# EAGLE design media_player_v0001a (EAGLE 6.4)

## Sheet 1 of 6: PSU
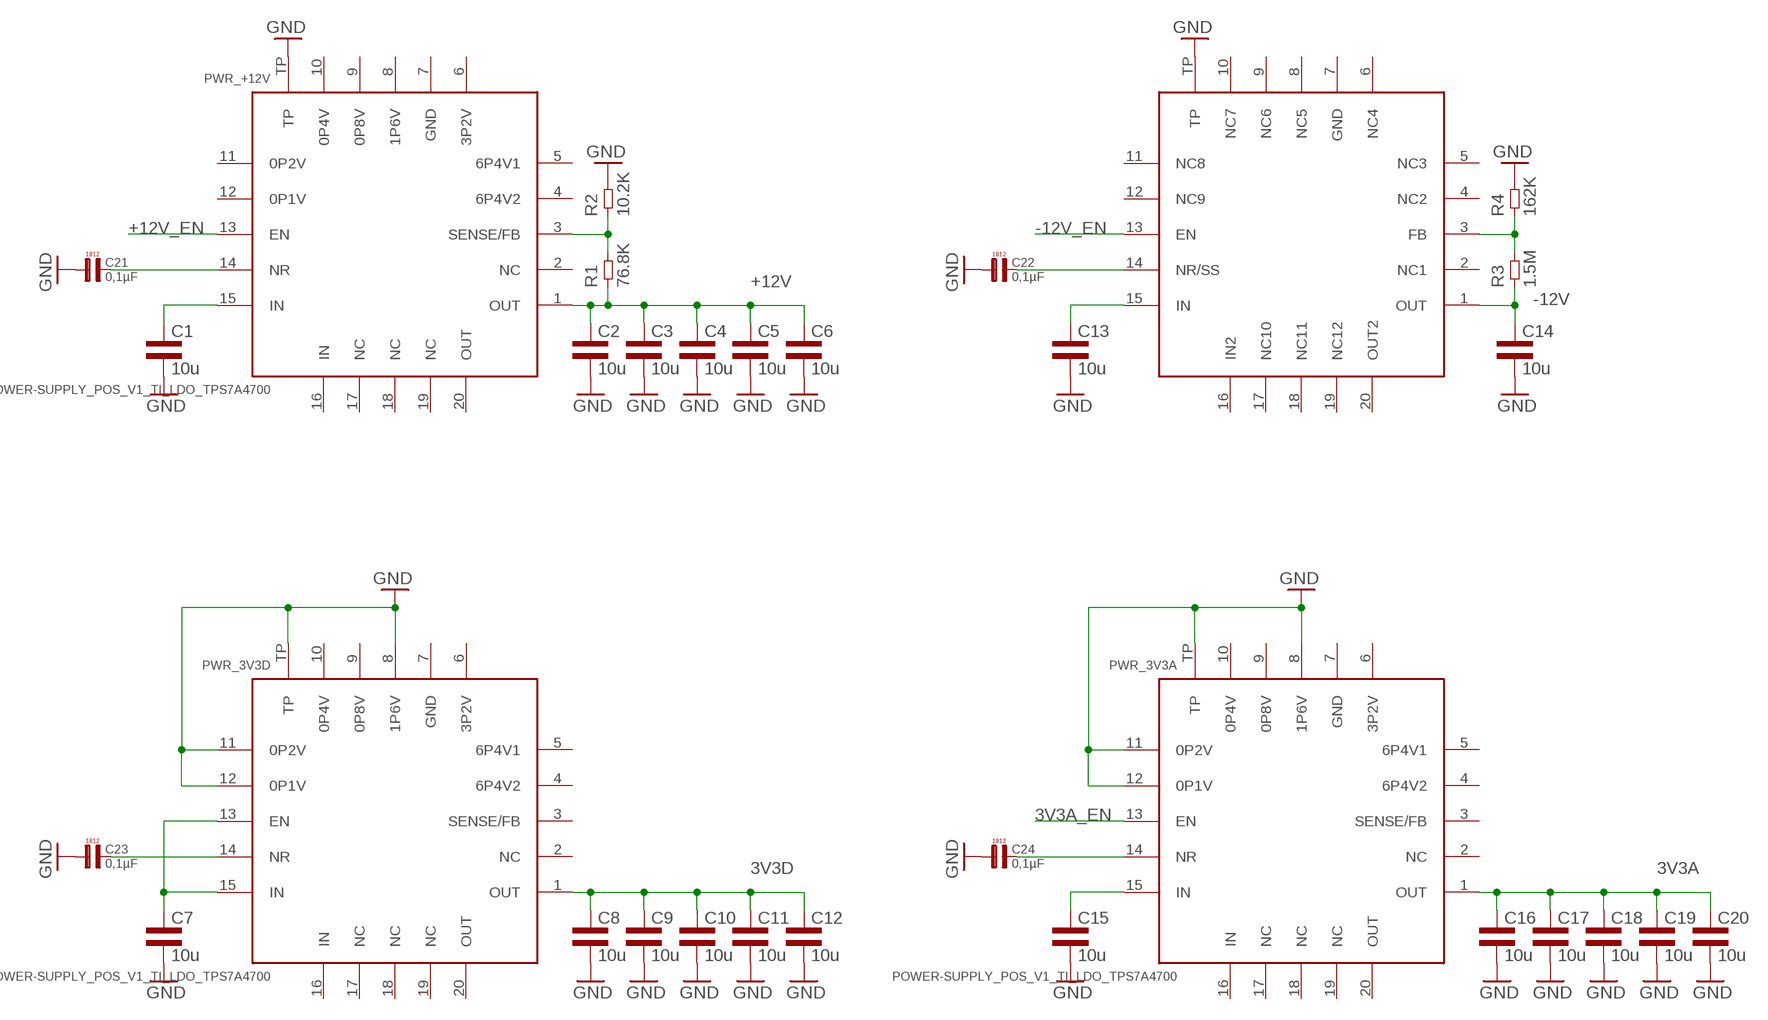
[diagram p0: schematic, sheet 1]

### Parts
C1  10u  CAP0805L3  [0805L3]
C2  10u  CAP0805L3  [0805L3]
C3  10u  CAP0805L3  [0805L3]
C4  10u  CAP0805L3  [0805L3]
C5  10u  CAP0805L3  [0805L3]
C6  10u  CAP0805L3  [0805L3]
C7  10u  CAP0805L3  [0805L3]
C8  10u  CAP0805L3  [0805L3]
C9  10u  CAP0805L3  [0805L3]
C10  10u  CAP0805L3  [0805L3]
C11  10u  CAP0805L3  [0805L3]
C12  10u  CAP0805L3  [0805L3]
C13  10u  CAP0805L3  [0805L3]
C14  10u  CAP0805L3  [0805L3]
C15  10u  CAP0805L3  [0805L3]
C16  10u  CAP0805L3  [0805L3]
C17  10u  CAP0805L3  [0805L3]
C18  10u  CAP0805L3  [0805L3]
C19  10u  CAP0805L3  [0805L3]
C20  10u  CAP0805L3  [0805L3]
C21  0,1µF  [L4,8]
C22  0,1µF  [L4,8]
C23  0,1µF  [L4,8]
C24  0,1µF  [L4,8]
PWR_3V3A  POWER-SUPPLY_POS_V1_TI_LDO_TPS7A4700  [POWER-SUPPLY_POS_V1_TI_LDO_VQFN-20]
PWR_3V3D  POWER-SUPPLY_POS_V1_TI_LDO_TPS7A4700  [POWER-SUPPLY_POS_V1_TI_LDO_VQFN-20]
PWR_+12V  POWER-SUPPLY_POS_V1_TI_LDO_TPS7A4700  [POWER-SUPPLY_POS_V1_TI_LDO_VQFN-20]
PWR_-12V  POWER-SUPPLY_POS_V1_TI_LDO_TPS7A3301RGWT  [POWER-SUPPLY_POS_V1_TI_LDO_VQFN-20]
R1  76.8K  RES0603L3  [0603L3]
R2  10.2K  RES0603L3  [0603L3]
R3  1.5M  RES0603L3  [0603L3]
R4  162K  RES0603L3  [0603L3]

### Nets
3V3A: C16.1 C17.1 C18.1 C19.1 C20.1 PWR_3V3A.1(OUT) ; also sheet 4
3V3A_EN: PWR_3V3A.13(EN)
3V3A_NR: C24.P$2 PWR_3V3A.14(NR)
3V3D: C8.1 C9.1 C10.1 C11.1 C12.1 PWR_3V3D.1(OUT) ; also sheet 2,3,4
3V3D_NR: C23.P$2 PWR_3V3D.14(NR)
+12V: C2.1 C3.1 C4.1 C5.1 C6.1 PWR_+12V.1(OUT) R1.P$1
+12V_EN: PWR_+12V.13(EN)
+12V_NR: C21.P$2 PWR_+12V.14(NR)
+12V_SENSE: PWR_+12V.3(SENSE/FB) R1.P$2 R2.P$1
-12V: C14.1 PWR_-12V.1(OUT) R3.P$1
-12V_EN: PWR_-12V.13(EN)
-12V_NR: C22.P$2 PWR_-12V.14(NR/SS)
-12V_SENSE: PWR_-12V.3(FB) R3.P$2 R4.P$1
GND: C1.2 C2.2 C3.2 C4.2 C5.2 C6.2 C7.2 C8.2 C9.2 C10.2 C11.2 C12.2 C13.2 C14.2 C15.2 C16.2 C17.2 C18.2 C19.2 C20.2 C21.P$1 C22.P$1 C23.P$1 C24.P$1 PWR_3V3A.8(1P6V) PWR_3V3A.11(0P2V) PWR_3V3A.12(0P1V) PWR_3V3A.TP PWR_3V3D.8(1P6V) PWR_3V3D.11(0P2V) PWR_3V3D.12(0P1V) PWR_3V3D.TP PWR_+12V.TP PWR_-12V.TP R2.P$2 R4.P$2 ; also sheet 2,3,4,6
VIN: C1.1 C7.1 C13.1 C15.1 PWR_3V3A.15(IN) PWR_3V3D.13(EN) PWR_3V3D.15(IN) PWR_+12V.15(IN) PWR_-12V.15(IN)
Unconnected: PWR_3V3A.2(NC) PWR_3V3A.3(SENSE/FB) PWR_3V3A.4(6P4V2) PWR_3V3A.5(6P4V1) PWR_3V3A.6(3P2V) PWR_3V3A.7(GND) PWR_3V3A.9(0P8V) PWR_3V3A.10(0P4V) PWR_3V3A.16(IN) PWR_3V3A.17(NC) PWR_3V3A.18(NC) PWR_3V3A.19(NC) PWR_3V3A.20(OUT) PWR_3V3D.2(NC) PWR_3V3D.3(SENSE/FB) PWR_3V3D.4(6P4V2) PWR_3V3D.5(6P4V1) PWR_3V3D.6(3P2V) PWR_3V3D.7(GND) PWR_3V3D.9(0P8V) PWR_3V3D.10(0P4V) PWR_3V3D.16(IN) PWR_3V3D.17(NC) PWR_3V3D.18(NC) PWR_3V3D.19(NC) PWR_3V3D.20(OUT) PWR_+12V.2(NC) PWR_+12V.4(6P4V2) PWR_+12V.5(6P4V1) PWR_+12V.6(3P2V) PWR_+12V.7(GND) PWR_+12V.8(1P6V) PWR_+12V.9(0P8V) PWR_+12V.10(0P4V) PWR_+12V.11(0P2V) PWR_+12V.12(0P1V) PWR_+12V.16(IN) PWR_+12V.17(NC) PWR_+12V.18(NC) PWR_+12V.19(NC) PWR_+12V.20(OUT) PWR_-12V.2(NC1) PWR_-12V.4(NC2) PWR_-12V.5(NC3) PWR_-12V.6(NC4) PWR_-12V.7(GND) PWR_-12V.8(NC5) PWR_-12V.9(NC6) PWR_-12V.10(NC7) PWR_-12V.11(NC8) PWR_-12V.12(NC9) PWR_-12V.16(IN2) PWR_-12V.17(NC10) PWR_-12V.18(NC11) PWR_-12V.19(NC12) PWR_-12V.20(OUT2)

### Notes on the sheet
- +12V
- -12V
- 3V3D | 3V3A

## Sheet 2 of 6: MCU
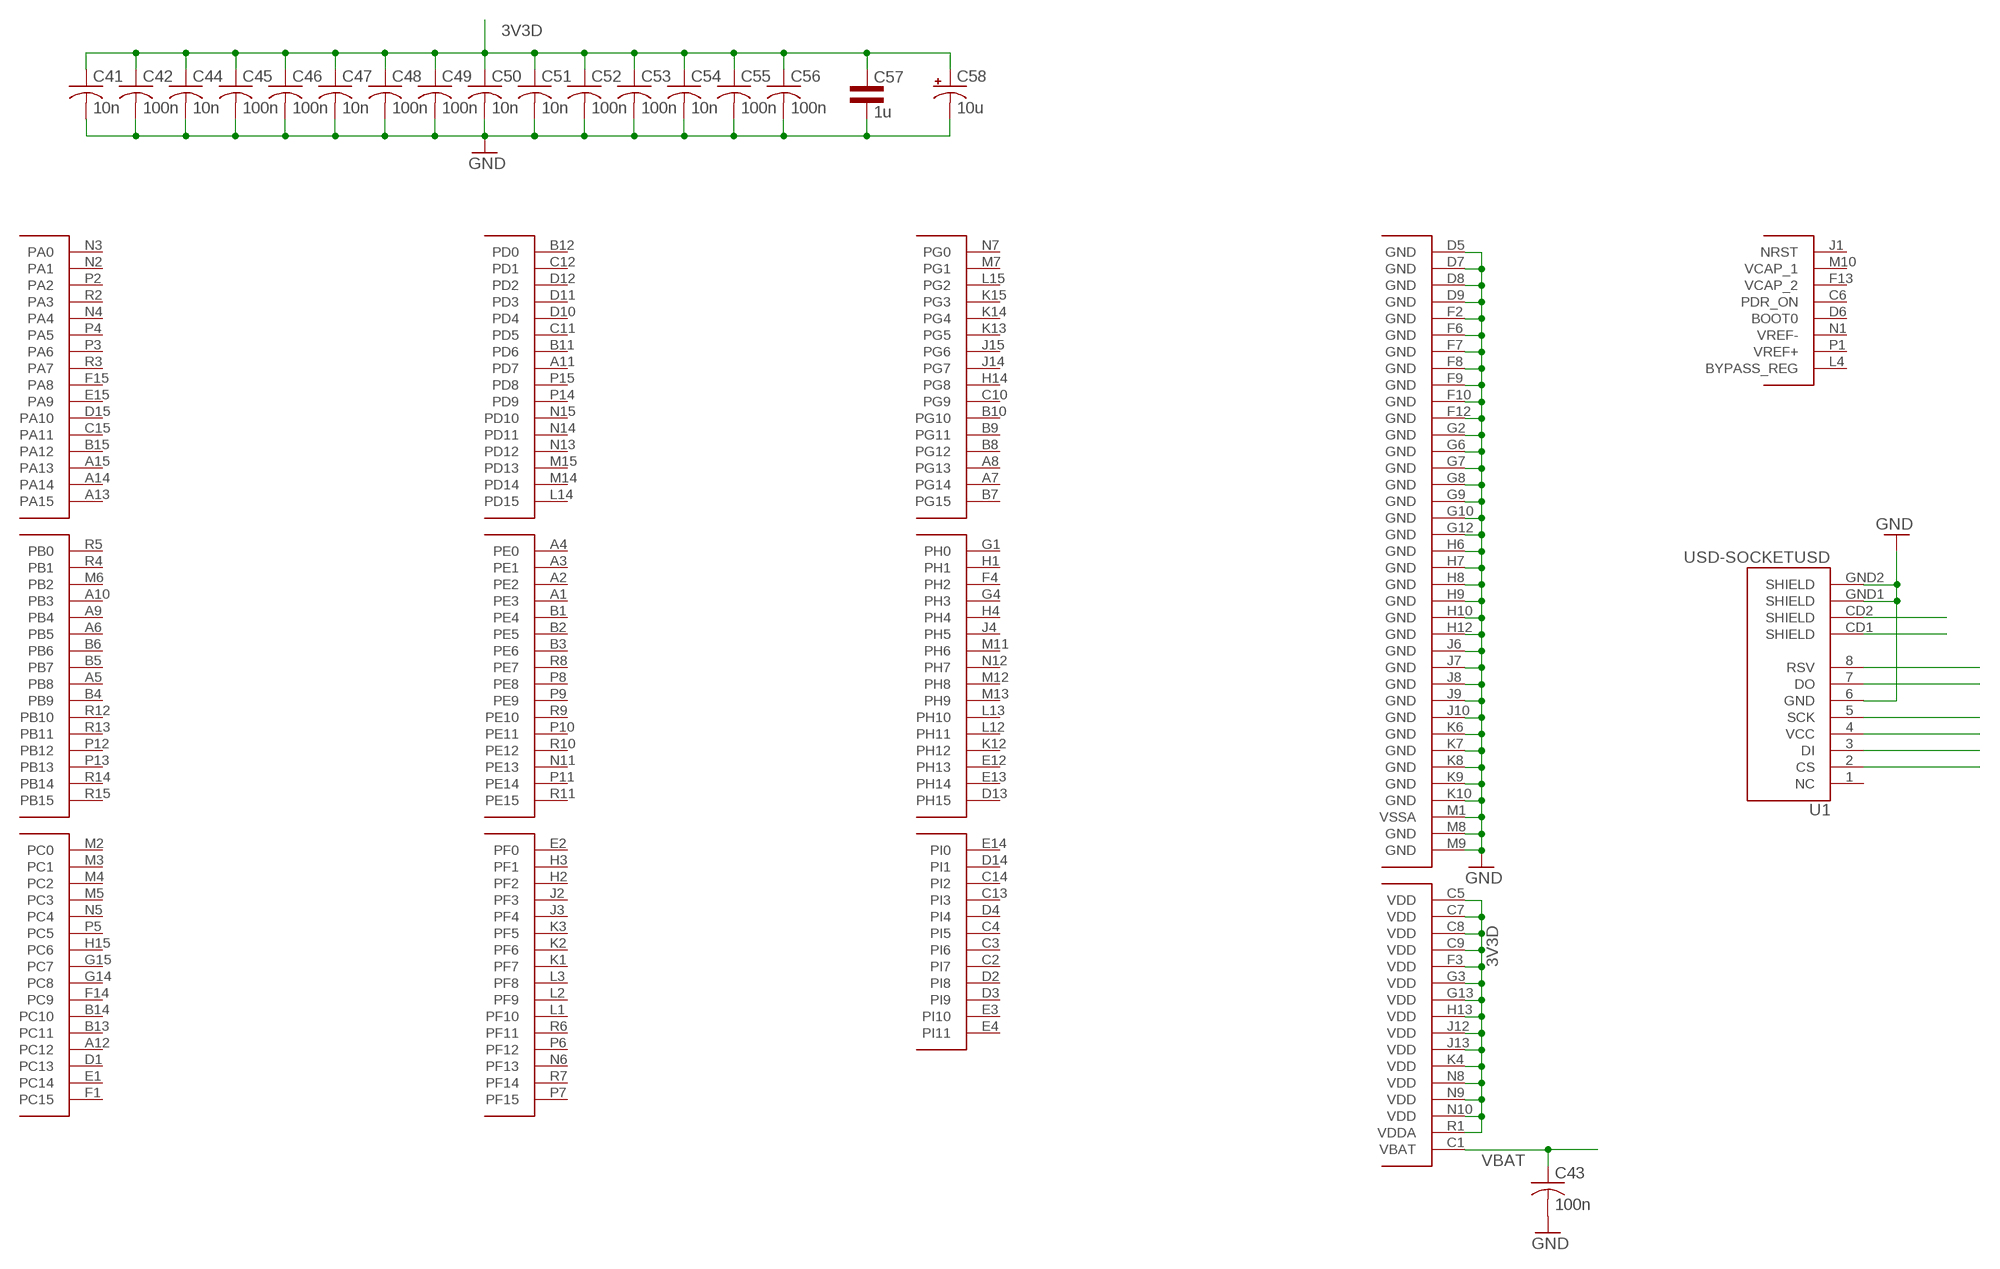
[diagram p1: schematic, sheet 2]

### Parts
C41  10n  C-USC0201  [C0201]
C42  100n  C-USC0201  [C0201]
C43  100n  C-USC0201  [C0201]
C44  10n  C-USC0201  [C0201]
C45  100n  C-USC0201  [C0201]
C46  100n  C-USC0201  [C0201]
C47  10n  C-USC0201  [C0201]
C48  100n  C-USC0201  [C0201]
C49  100n  C-USC0201  [C0201]
C50  10n  C-USC0201  [C0201]
C51  10n  C-USC0201  [C0201]
C52  100n  C-USC0201  [C0201]
C53  100n  C-USC0201  [C0201]
C54  10n  C-USC0201  [C0201]
C55  100n  C-USC0201  [C0201]
C56  100n  C-USC0201  [C0201]
C57  1u  CAP0805L3  [0805L3]
C58  10u  CPOL-USA/3216-18R  [A/3216-18R]
U1  USD-SOCKETUSD  [USD-SOCKET-PP]
U$1  STM32_32BIT_MCU_STM32F407IG  [STM32_32BIT_MCU_UFBGA176+25]

### Nets
3V3D: C41.1 C42.1 C44.1 C45.1 C46.1 C47.1 C48.1 C49.1 C50.1 C51.1 C52.1 C53.1 C54.1 C55.1 C56.1 C57.1 C58.+ U$1.C5(VDD) U$1.C7(VDD) U$1.C8(VDD) U$1.C9(VDD) U$1.F3(VDD) U$1.G3(VDD) U$1.G13(VDD) U$1.H13(VDD) U$1.J12(VDD) U$1.J13(VDD) U$1.K4(VDD) U$1.N8(VDD) U$1.N9(VDD) U$1.N10(VDD) U$1.R1(VDDA) ; also sheet 1,3,4
GND: C41.2 C42.2 C43.2 C44.2 C45.2 C46.2 C47.2 C48.2 C49.2 C50.2 C51.2 C52.2 C53.2 C54.2 C55.2 C56.2 C57.2 C58.- U1.6(GND) U1.GND1(SHIELD) U1.GND2(SHIELD) U$1.D5(GND) U$1.D7(GND) U$1.D8(GND) U$1.D9(GND) U$1.F2(GND) U$1.F6(GND) U$1.F7(GND) U$1.F8(GND) U$1.F9(GND) U$1.F10(GND) U$1.F12(GND) U$1.G2(GND) U$1.G6(GND) U$1.G7(GND) U$1.G8(GND) U$1.G9(GND) U$1.G10(GND) U$1.G12(GND) U$1.H6(GND) U$1.H7(GND) U$1.H8(GND) U$1.H9(GND) U$1.H10(GND) U$1.H12(GND) U$1.J6(GND) U$1.J7(GND) U$1.J8(GND) U$1.J9(GND) U$1.J10(GND) U$1.K6(GND) U$1.K7(GND) U$1.K8(GND) U$1.K9(GND) U$1.K10(GND) U$1.M1(VSSA) U$1.M8(GND) U$1.M9(GND) ; also sheet 1,3,4,6
N$22: U1.2(CS)
N$23: U1.3(DI)
N$24: U1.4(VCC)
N$25: U1.5(SCK)
N$27: U1.7(DO)
N$28: U1.8(RSV)
N$31: U1.CD2(SHIELD)
N$32: U1.CD1(SHIELD)
VBAT: C43.1 U$1.C1(VBAT)
Unconnected: U1.1(NC) U$1.A1(PE3) U$1.A2(PE2) U$1.A3(PE1) U$1.A4(PE0) U$1.A5(PB8) U$1.A6(PB5) U$1.A7(PG14) U$1.A8(PG13) U$1.A9(PB4) U$1.A10(PB3) U$1.A11(PD7) U$1.A12(PC12) U$1.A13(PA15) U$1.A14 U$1.A15(PA13) U$1.B1(PE4) U$1.B2(PE5) U$1.B3(PE6) U$1.B4(PB9) U$1.B5(PB7) U$1.B6 U$1.B7(PG15) U$1.B8(PG12) U$1.B9(PG11) U$1.B10(PG10) U$1.B11(PD6) U$1.B12(PD0) U$1.B13(PC11) U$1.B14(PC10) U$1.B15(PA12) U$1.C2(PI7) U$1.C3(PI6) U$1.C4(PI5) U$1.C6(PDR_ON) U$1.C10(PG9) U$1.C11(PD5) U$1.C12(PD1) U$1.C13(PI3) U$1.C14(PI2) U$1.C15(PA11) U$1.D1(PC13) U$1.D2(PI8) U$1.D3(PI9) U$1.D4(PI4) U$1.D6(BOOT0) U$1.D10(PD4) U$1.D11(PD3) U$1.D12(PD2) U$1.D13(PH15) U$1.D14(PI1) U$1.D15(PA10) U$1.E1(PC14) U$1.E2(PF0) U$1.E3(PI10) U$1.E4(PI11) U$1.E12(PH13) U$1.E13(PH14) U$1.E14(PI0) U$1.E15(PA9) U$1.F1(PC15) U$1.F4(PH2) U$1.F13(VCAP_2) U$1.F14(PC9) U$1.F15(PA8) U$1.G1(PH0) U$1.G4(PH3) U$1.G14(PC8) U$1.G15(PC7) U$1.H1 U$1.H2(PF2) U$1.H3(PF1) U$1.H4 U$1.H14(PG8) U$1.H15(PC6) U$1.J1(NRST) U$1.J2(PF3) U$1.J3(PF4) U$1.J4(PH5) U$1.J14(PG7) U$1.J15(PG6) U$1.K1(PF7) U$1.K2(PF6) U$1.K3(PF5) U$1.K12(PH12) U$1.K13(PG5) U$1.K14(PG4) U$1.K15(PG3) U$1.L1(PF10) U$1.L2(PF9) U$1.L3(PF8) U$1.L4(BYPASS_REG) U$1.L12(PH11) U$1.L13(PH10) U$1.L14(PD15) U$1.L15(PG2) U$1.M2(PC0) U$1.M3(PC1) U$1.M4(PC2) U$1.M5(PC3) U$1.M6(PB2) U$1.M7(PG1) U$1.M10(VCAP_1) U$1.M11(PH6) U$1.M12(PH8) U$1.M13(PH9) U$1.M14(PD14) U$1.M15(PD13) U$1.N1(VREF-) U$1.N2(PA1) U$1.N3(PA0) U$1.N4(PA4) U$1.N5(PC4) U$1.N6(PF13) U$1.N7(PG0) U$1.N11(PE13) U$1.N12(PH7) U$1.N13(PD12) U$1.N14(PD11) U$1.N15(PD10) U$1.P1(VREF+) U$1.P2(PA2) U$1.P3(PA6) U$1.P4(PA5) U$1.P5(PC5) U$1.P6(PF12) U$1.P7(PF15) U$1.P8(PE8) U$1.P9(PE9) U$1.P10(PE11) U$1.P11(PE14) U$1.P12(PB12) U$1.P13(PB13) U$1.P14(PD9) U$1.P15(PD8) U$1.R2(PA3) U$1.R3(PA7) U$1.R4(PB1) U$1.R5(PB0) U$1.R6(PF11) U$1.R7(PF14) U$1.R8(PE7) U$1.R9(PE10) U$1.R10(PE12) U$1.R11(PE15) U$1.R12(PB10) U$1.R13(PB11) U$1.R14(PB14) U$1.R15(PB15)

## Sheet 3 of 6: SRAM
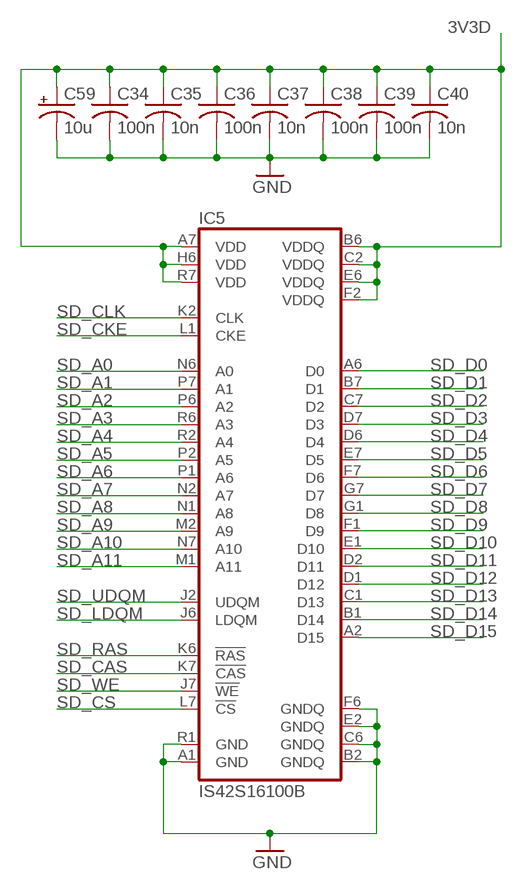
[diagram p2: schematic, sheet 3]

### Parts
C34  100n  C-USC0201  [C0201]
C35  10n  C-USC0201  [C0201]
C36  100n  C-USC0201  [C0201]
C37  10n  C-USC0201  [C0201]
C38  100n  C-USC0201  [C0201]
C39  100n  C-USC0201  [C0201]
C40  10n  C-USC0201  [C0201]
C59  10u  CPOL-USA/3216-18R  [A/3216-18R]
IC5  IS42S16100B  [MBGA60]

### Nets
3V3D: C34.1 C35.1 C36.1 C37.1 C38.1 C39.1 C40.1 C59.+ IC5.A7(VDD) IC5.B6(VDDQ) IC5.C2(VDDQ) IC5.E6(VDDQ) IC5.F2(VDDQ) IC5.H6(VDD) IC5.R7(VDD) ; also sheet 1,2,4
GND: C34.2 C35.2 C36.2 C37.2 C38.2 C39.2 C40.2 C59.- IC5.A1(GND) IC5.B2(GNDQ) IC5.C6(GNDQ) IC5.E2(GNDQ) IC5.F6(GNDQ) IC5.R1(GND) ; also sheet 1,2,4,6
SD_A0: IC5.N6(A0)
SD_A1: IC5.P7(A1)
SD_A2: IC5.P6(A2)
SD_A3: IC5.R6(A3)
SD_A4: IC5.R2(A4)
SD_A5: IC5.P2(A5)
SD_A6: IC5.P1(A6)
SD_A7: IC5.N2(A7)
SD_A8: IC5.N1(A8)
SD_A9: IC5.M2(A9)
SD_A10: IC5.N7(A10)
SD_A11: IC5.M1(A11)
SD_CAS: IC5.K7(!CAS)
SD_CKE: IC5.L1(CKE)
SD_CLK: IC5.K2(CLK)
SD_CS: IC5.L7(!CS)
SD_D0: IC5.A6(D0)
SD_D1: IC5.B7(D1)
SD_D2: IC5.C7(D2)
SD_D3: IC5.D7(D3)
SD_D4: IC5.D6(D4)
SD_D5: IC5.E7(D5)
SD_D6: IC5.F7(D6)
SD_D7: IC5.G7(D7)
SD_D8: IC5.G1(D8)
SD_D9: IC5.F1(D9)
SD_D10: IC5.E1(D10)
SD_D11: IC5.D2(D11)
SD_D12: IC5.D1(D12)
SD_D13: IC5.C1(D13)
SD_D14: IC5.B1(D14)
SD_D15: IC5.A2(D15)
SD_LDQM: IC5.J6(LDQM)
SD_RAS: IC5.K6(!RAS)
SD_UDQM: IC5.J2(UDQM)
SD_WE: IC5.J7(!WE)

## Sheet 4 of 6: DAC
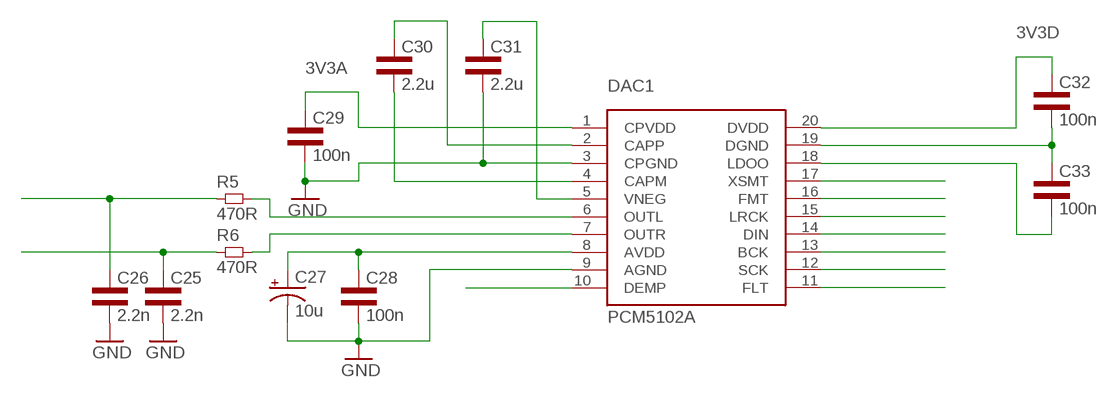
[diagram p3: schematic, sheet 4]

### Parts
C25  2.2n  CAP0805L3  [0805L3]
C26  2.2n  CAP0805L3  [0805L3]
C27  10u  CPOL-USA/3216-18R  [A/3216-18R]
C28  100n  CAP0603L3  [0603L3]
C29  100n  CAP0603L3  [0603L3]
C30  2.2u  CAP0805L3  [0805L3]
C31  2.2u  CAP0805L3  [0805L3]
C32  100n  CAP0603L3  [0603L3]
C33  100n  CAP0603L3  [0603L3]
DAC1  PCM5102A  [R-PDSO-G20_65]
R5  470R  RES0805L3  [0805L3]
R6  470R  RES0805L3  [0805L3]

### Nets
3V3A: C29.P$1 DAC1.1(CPVDD) ; also sheet 1
3V3D: C32.P$1 DAC1.20(DVDD) ; also sheet 1,2,3
GND: C25.2 C26.2 C27.- C28.P$2 C29.P$2 C31.2 DAC1.3(CPGND) DAC1.9(AGND) ; also sheet 1,2,3,6
N$1: C25.1 R6.1
N$2: C26.1 R5.1
N$3: DAC1.6(OUTL) R5.2
N$4: DAC1.7(OUTR) R6.2
N$5: C27.+ C28.P$1 DAC1.8(AVDD)
N$8: C30.2 DAC1.4(CAPM)
N$9: C30.1 DAC1.2(CAPP)
N$10: C31.1 DAC1.5(VNEG)
N$11: C32.P$2 C33.P$1 DAC1.19(DGND)
N$12: C33.P$2 DAC1.18(LDOO)
N$14: DAC1.17(XSMT)
N$15: DAC1.16(FMT)
N$16: DAC1.15(LRCK)
N$17: DAC1.14(DIN)
N$18: DAC1.13(BCK)
N$19: DAC1.12(SCK)
N$20: DAC1.11(FLT)
N$21: DAC1.10(DEMP)

## Sheet 5 of 6: Amplifier
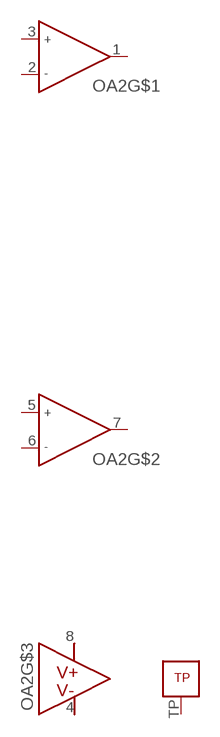
[diagram p4: schematic, sheet 5]

### Parts
OA2  OPA1612  [S-PWSON-N8]
Unconnected: OA2.1(OUTA) OA2.2(INA-) OA2.3(INA+) OA2.5(INB+) OA2.6(INB-) OA2.7(OUTB) OA2.TP

## Sheet 6 of 6: Buffer
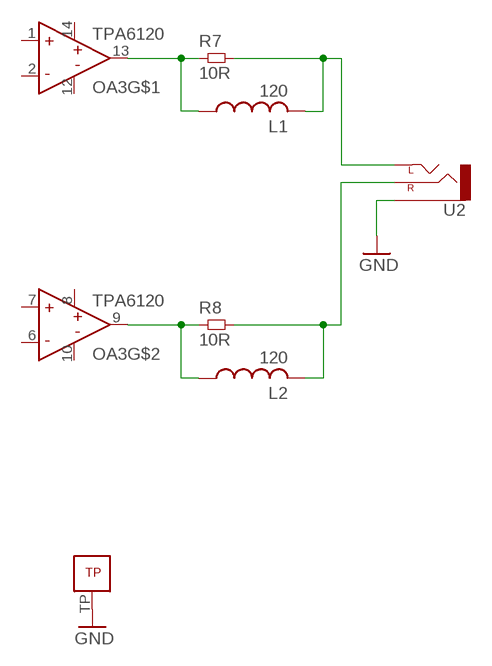
[diagram p5: schematic, sheet 6]

### Parts
L1  120  L-USL2012C  [L2012C]
L2  120  L-USL2012C  [L2012C]
OA3  TPA6120QFN  [S-PVQFN-N14]
R7  10R  RES0805L3  [0805L3]
R8  10R  RES0805L3  [0805L3]
U2  AUDIO-JACKSMD2  [AUDIO-JACK-3.5MM-SMD]

### Nets
GND: OA3.TP U2.SLEEVE ; also sheet 1,2,3,4
N$7: L2.1 OA3.9(OUT) R8.1
N$13: L2.2 R8.2 U2.RING(RIGHT)
N$26: L1.2 R7.2 U2.TIP(LEFT)
N$29: L1.1 OA3.13(OUT) R7.1
Unconnected: OA3.1(IN+) OA3.2(IN-) OA3.6(IN-) OA3.7(IN+) OA3.8(V+) OA3.10(V-) OA3.12(V-) OA3.14(V+)

## Power pins joined to a net without a drawn wire
V+: OA2.8(V+)
V-: OA2.4(V-)

## Library data of the parts
C1-C20 C25 C26 C28-C33 C57 = common:CAP
C21-C24 = Capacitor-Wima-SMD1812-63v:0,1µF
C27 C58 C59 = rcl:CPOL-US: POLARIZED CAPACITOR, American symbol
C34-C56 = rcl:C-US: CAPACITOR, American symbol
DAC1 = common:PCM5102A: PCM5102A - 32-Bit, 384KHz stereo DAC with I2S PCM interface.
IC5 = memory:IS42S16100B: 512K Words x 16 Bits x 2 Banks (16-MBIT) SYNCHRONOUS DYNAMIC RAM Source: www.issi.com .. IS42S16100.pdf
L1 L2 = rcl:L-US: INDUCTOR, American symbol
OA2 = common:OPA1612
OA3 = common:TPA6120
PWR_3V3A PWR_3V3D PWR_+12V = my_dac_amp:POWER-SUPPLY_POS_V1_TI_LDO_TPS7A4700
PWR_-12V = my_dac_amp:POWER-SUPPLY_POS_V1_TI_LDO_TPS7A3301RGWT: Ultra-Low Noise NEGATIVE Voltage Reglator
R1-R8 = common:RES
U1 = SparkFun-Connectors:USD-SOCKET: microSD Socket Push-push type uSD socket. Schematic element and footprint production proven. Spark Fun Electronics SKU : PRT-00127. tDoc lines correctly indicate media card edge positions when inserting (unlocked, locked, depressed).
U2 = SparkFun-Connectors:AUDIO-JACK: 3.5mm Audio Jack Simple 3.5mm common PCB mount audio jack. SKU: PRT-08032
U$1 = stm32f407ig_breakout:STM32_32BIT_MCU_STM32F407IG

## Board
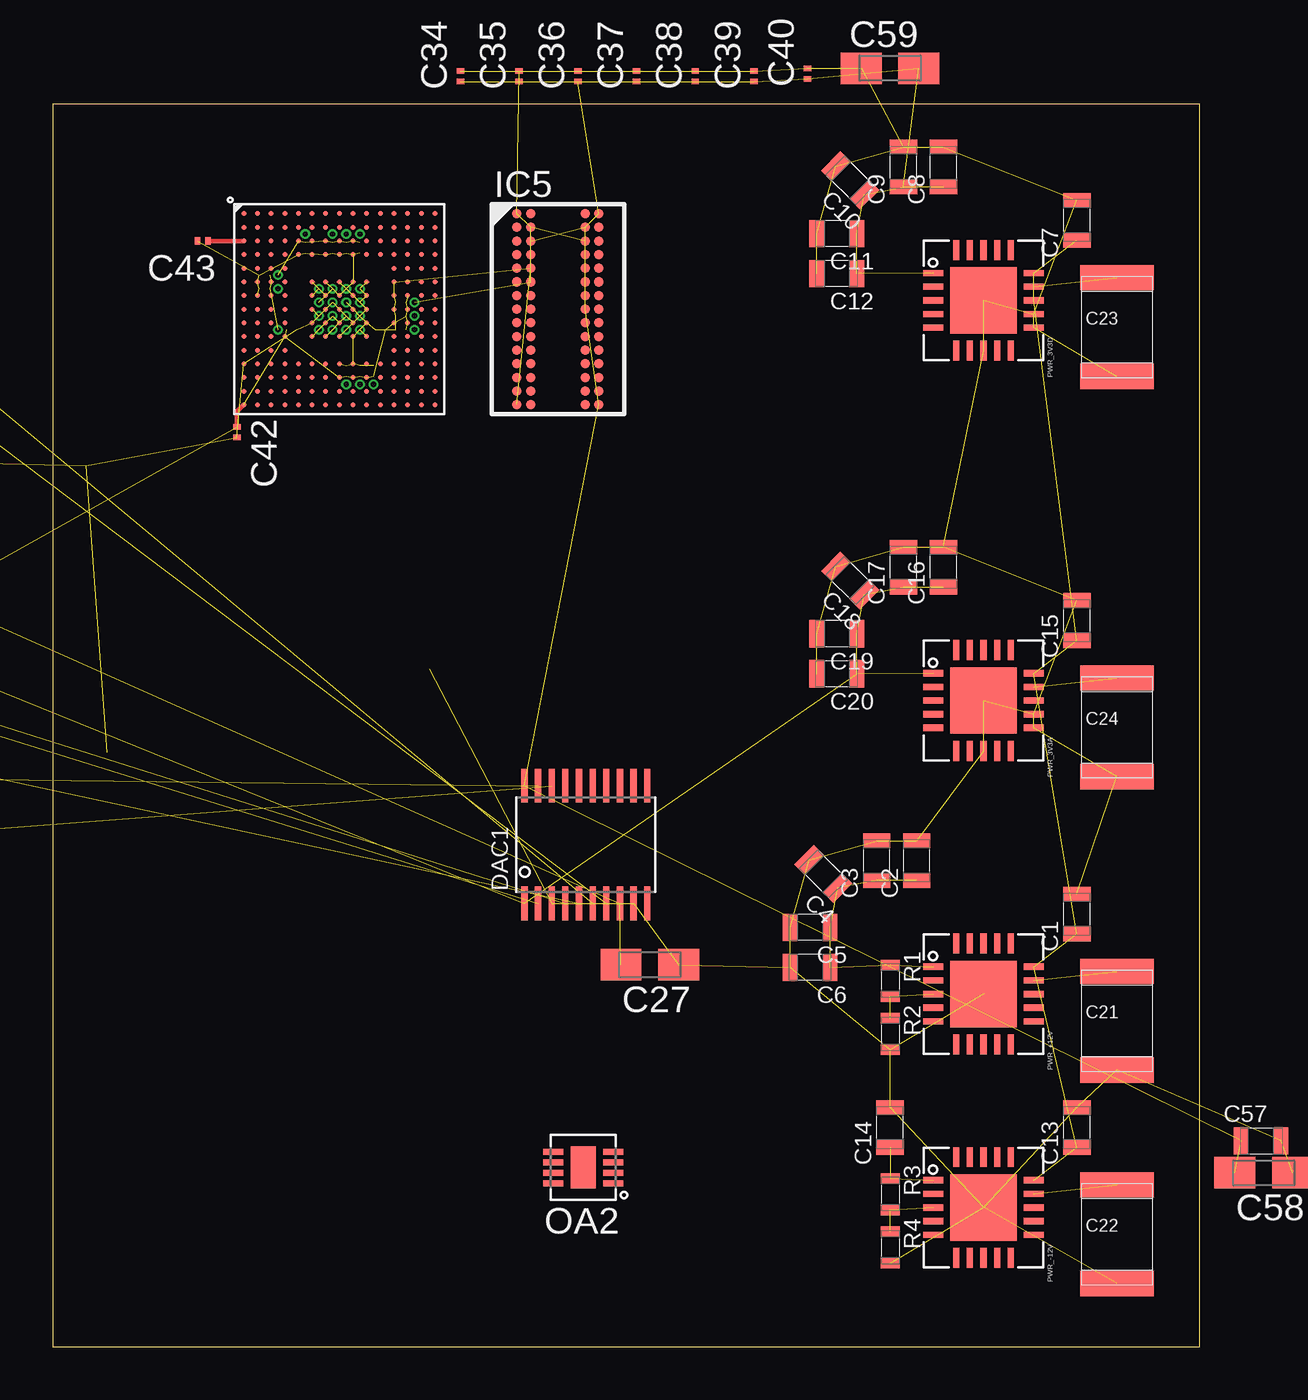
[diagram p6: board, top side]
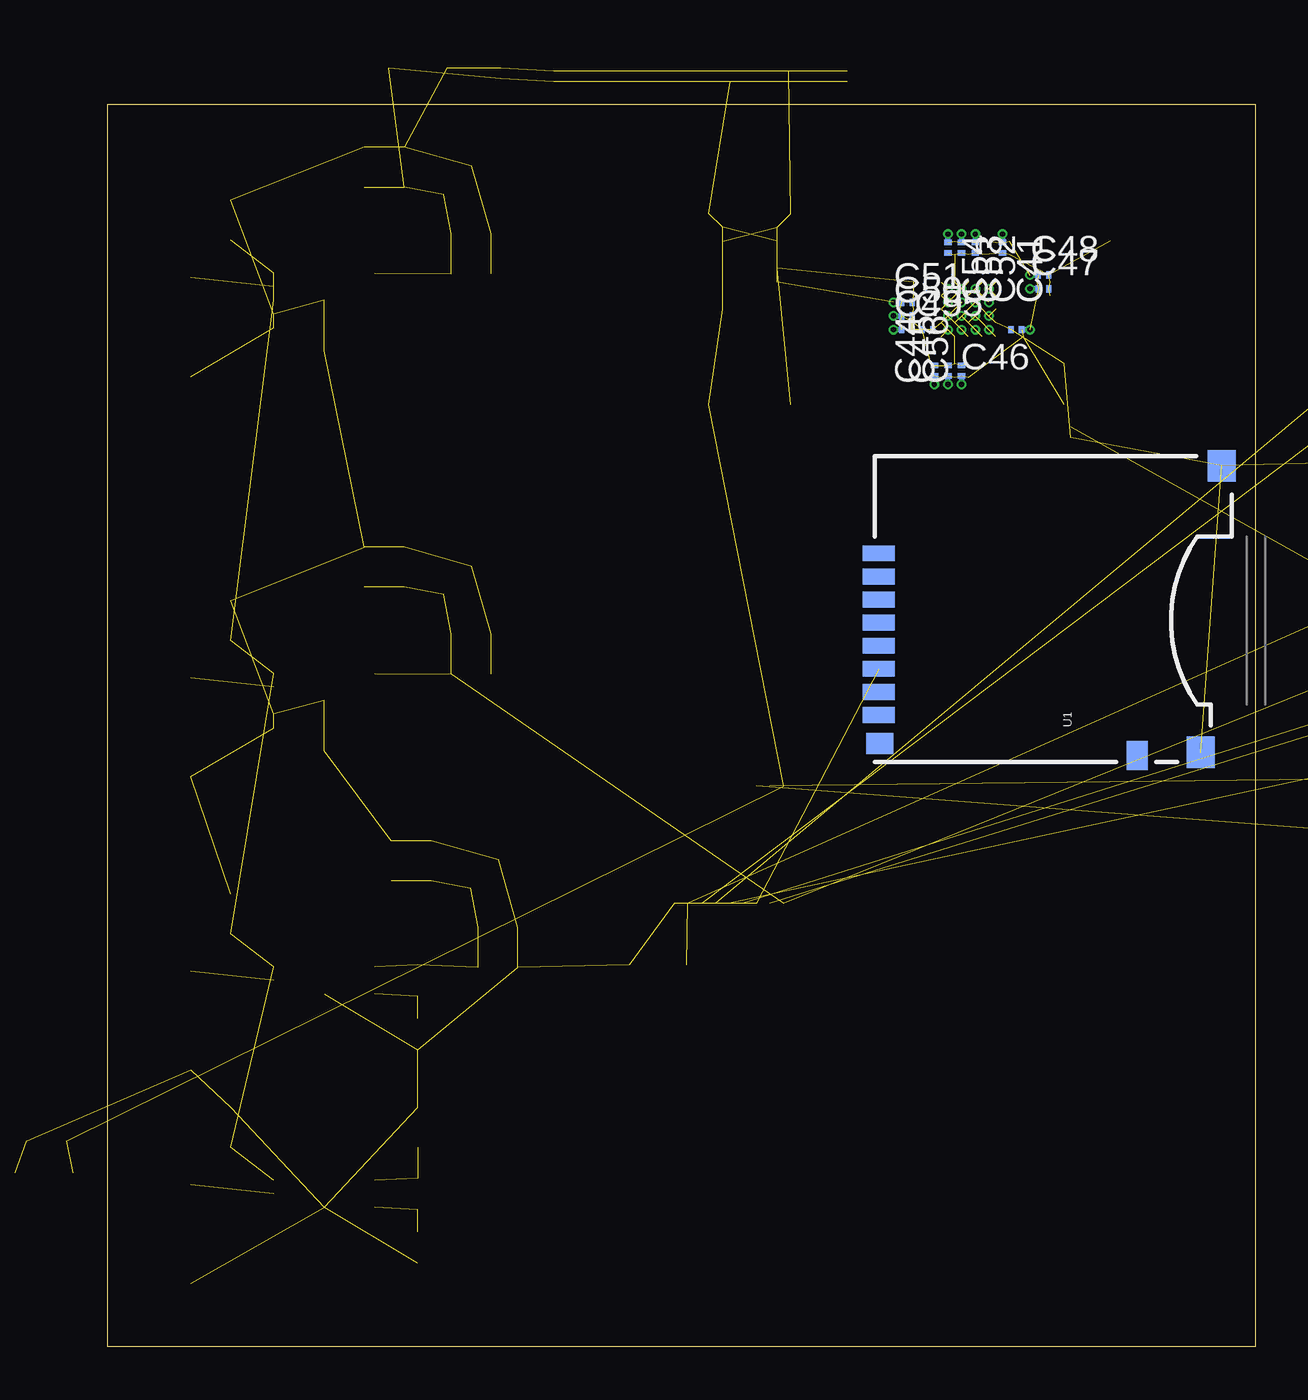
[diagram p7: board, bottom side, seen from below]

Size 54.6 x 59.15 mm. Coordinates in mm from the lower left corner, seen from the top.
Outline: 0,0 54.6,0 54.6,59.15 0,59.15 0,0
Copper layers (1*16): Top 0.035mm / dielectric 1.5mm / Bottom 0.035mm
Design rules "default *": minimum track width 10mil, minimum drill 10mil, track to track 8mil, track to pad 8mil, pad to pad 8mil, via to via 8mil, smd to smd 8mil, copper to edge 40mil, drill to drill 8mil, minimum pad ring 4mil, minimum via ring 4mil, stop-mask expansion 4mil, vias tented up to drill 0mil, thermal gap 10mil

### Footprints (pad centres in the part's own frame; a part is rotated, then mirrored left to right if it is on the bottom)
0805L3 = smd 0.7 x 1.3: 1 -0.95,0; 2 0.95,0
L4,8 = smd 3.5 x 1.2: P$1 0,-2.35; P$2 0,2.35
A/3216-18R = smd 1.95 x 1.5: + 1.375,0; - -1.375,0
0603L3 = smd 0.5 x 0.9: P$1 -0.75,0; P$2 0.75,0
C0201 = smd 0.25 x 0.35: 1 -0.25,0; 2 0.25,0
R-PDSO-G20_65 = smd 0.3 x 1.6: 1 -2.925,-2.8; 2 -2.275,-2.8; 3 -1.625,-2.8; 4 -0.975,-2.8; 5 -0.325,-2.8; 6 0.325,-2.8; 7 0.975,-2.8; 8 1.625,-2.8; 9 2.275,-2.8; 10 2.925,-2.8; 11 2.925,2.8; 12 2.275,2.8; 13 1.625,2.8; 14 0.975,2.8; 15 0.325,2.8; 16 -0.325,2.8; 17 -0.975,2.8; 18 -1.625,2.8; 19 -2.275,2.8; 20 -2.925,2.8
MBGA60 = smd 0.45 x 0.45: A1 -1.95,4.55; A2 -1.3,4.55; A6 1.3,4.55; A7 1.95,4.55; B1 -1.95,3.9; B2 -1.3,3.9; B6 1.3,3.9; B7 1.95,3.9; C1 -1.95,3.25; C2 -1.3,3.25; C6 1.3,3.25; C7 1.95,3.25; D1 -1.95,2.6; D2 -1.3,2.6; D6 1.3,2.6; D7 1.95,2.6; E1 -1.95,1.95; E2 -1.3,1.95; E6 1.3,1.95; E7 1.95,1.95; F1 -1.95,1.3; F2 -1.3,1.3; F6 1.3,1.3; F7 1.95,1.3; G1 -1.95,0.65; G2 -1.3,0.65; G6 1.3,0.65; G7 1.95,0.65; H1 -1.95,0; H2 -1.3,0; H6 1.3,0; H7 1.95,0; J1 -1.95,-0.65; J2 -1.3,-0.65; J6 1.3,-0.65; J7 1.95,-0.65; K1 -1.95,-1.3; K2 -1.3,-1.3; K6 1.3,-1.3; K7 1.95,-1.3; L1 -1.95,-1.95; L2 -1.3,-1.95; L6 1.3,-1.95; L7 1.95,-1.95; M1 -1.95,-2.6; M2 -1.3,-2.6; M6 1.3,-2.6; M7 1.95,-2.6; N1 -1.95,-3.25; N2 -1.3,-3.25; N6 1.3,-3.25; N7 1.95,-3.25; P1 -1.95,-3.9; P2 -1.3,-3.9; P6 1.3,-3.9; P7 1.95,-3.9; R1 -1.95,-4.55; R2 -1.3,-4.55; R6 1.3,-4.55; R7 1.95,-4.55
L2012C = smd 1 x 1: 1 -1,0; 2 1,0
S-PWSON-N8 = smd 0.28 x 0.95: 1 -0.75,-1.425; 2 -0.25,-1.425; 3 0.25,-1.425; 4 0.75,-1.425; 5 0.75,1.425; 6 0.25,1.425; 7 -0.25,1.425; 8 -0.75,1.425 | smd 2 x 1.2: TP 0,0
S-PVQFN-N14 = smd 0.85 x 0.28: 1 -1.725,-0.75; 7 1.725,-0.75; 8 1.725,0.75; 14 -1.725,0.75 | smd 0.28 x 0.85: 2 -1,-1.725; 3 -0.5,-1.725; 4 0,-1.725; 5 0.5,-1.725; 6 1,-1.725; 9 1,1.725; 10 0.5,1.725; 11 0,1.725; 12 -0.5,1.725; 13 -1,1.725 | smd 2.05 x 2.05: TP 0,0
POWER-SUPPLY_POS_V1_TI_LDO_VQFN-20 = smd 0.3 x 0.95: 1 -1.3,-2.4; 2 -0.65,-2.4; 3 0,-2.4; 4 0.65,-2.4; 5 1.3,-2.4; 11 1.3,2.4; 12 0.65,2.4; 13 0,2.4; 14 -0.65,2.4; 15 -1.3,2.4 | smd 0.95 x 0.3: 6 2.4,-1.3; 7 2.4,-0.65; 8 2.4,0; 9 2.4,0.65; 10 2.4,1.3; 16 -2.4,1.3; 17 -2.4,0.65; 18 -2.4,0; 19 -2.4,-0.65; 20 -2.4,-1.3 | smd 3.15 x 3.15: TP 0,0
USD-SOCKET-PP = smd 0.75 x 1.5: 1 3.2,16.8; 2 2.1,16.8; 3 1,16.8; 4 -0.1,16.8; 5 -1.2,16.8; 6 -2.3,16.8; 7 -3.4,16.8; 8 -4.5,16.8 | smd 1 x 1.3: CD1 -5.85,16.75 | smd 1.4 x 1: CD2 -6.425,4.5 | smd 1.5 x 1.35: GND1 -6.275,1.475; GND2 7.375,0.475
AUDIO-JACK-3.5MM-SMD = smd 2 x 2.5: RING 4.3,3.45; SLEEVE 2.5,-3.45; TIP 11.7,-3.45 | smd 1.2 x 2.5: RSH 1.5,3.45 | smd 2.5 x 2: TSH 15.75,0.75 | hole 2: 3.5,0; 10.5,0
STM32_32BIT_MCU_UFBGA176+25 = smd 0.23 x 0.23: A1 -4.55,4.55; A2 -3.9,4.55; A3 -3.25,4.55; A4 -2.6,4.55; A5 -1.95,4.55; A6 -1.3,4.55; A7 -0.65,4.55; A8 0,4.55; A9 0.65,4.55; A10 1.3,4.55; A11 1.95,4.55; A12 2.6,4.55; A13 3.25,4.55; A14 3.9,4.55; A15 4.55,4.55; B1 -4.55,3.9; B2 -3.9,3.9; B3 -3.25,3.9; B4 -2.6,3.9; B5 -1.95,3.9; B6 -1.3,3.9; B7 -0.65,3.9; B8 0,3.9; B9 0.65,3.9; B10 1.3,3.9; B11 1.95,3.9; B12 2.6,3.9; B13 3.25,3.9; B14 3.9,3.9; B15 4.55,3.9; C1 -4.55,3.25; C2 -3.9,3.25; C3 -3.25,3.25; C4 -2.6,3.25; C5 -1.95,3.25; C6 -1.3,3.25; C7 -0.65,3.25; C8 0,3.25; C9 0.65,3.25; C10 1.3,3.25; C11 1.95,3.25; C12 2.6,3.25; C13 3.25,3.25; C14 3.9,3.25; C15 4.55,3.25; D1 -4.55,2.6; D2 -3.9,2.6; D3 -3.25,2.6; D4 -2.6,2.6; D5 -1.95,2.6; D6 -1.3,2.6; D7 -0.65,2.6; D8 0,2.6; D9 0.65,2.6; D10 1.3,2.6; D11 1.95,2.6; D12 2.6,2.6; D13 3.25,2.6; D14 3.9,2.6; D15 4.55,2.6; E1 -4.55,1.95; E2 -3.9,1.95; E3 -3.25,1.95; E4 -2.6,1.95; E12 2.6,1.95; E13 3.25,1.95; E14 3.9,1.95; E15 4.55,1.95; F1 -4.55,1.3; F2 -3.9,1.3; F3 -3.25,1.3; F4 -2.6,1.3; F6 -1.3,1.3; F7 -0.65,1.3; F8 0,1.3; F9 0.65,1.3; F10 1.3,1.3; F12 2.6,1.3; F13 3.25,1.3; F14 3.9,1.3; F15 4.55,1.3; G1 -4.55,0.65; G2 -3.9,0.65; G3 -3.25,0.65; G4 -2.6,0.65; G6 -1.3,0.65; G7 -0.65,0.65; G8 0,0.65; G9 0.65,0.65; G10 1.3,0.65; G12 2.6,0.65; G13 3.25,0.65; G14 3.9,0.65; G15 4.55,0.65; H1 -4.55,0; H2 -3.9,0; H3 -3.25,0; H4 -2.6,0; H6 -1.3,0; H7 -0.65,0; H8 0,0; H9 0.65,0; H10 1.3,0; H12 2.6,0; H13 3.25,0; H14 3.9,0; H15 4.55,0; J1 -4.55,-0.65; J2 -3.9,-0.65; J3 -3.25,-0.65; J4 -2.6,-0.65; J6 -1.3,-0.65; J7 -0.65,-0.65; J8 0,-0.65; J9 0.65,-0.65; J10 1.3,-0.65; J12 2.6,-0.65; J13 3.25,-0.65; J14 3.9,-0.65; J15 4.55,-0.65; K1 -4.55,-1.3; K2 -3.9,-1.3; K3 -3.25,-1.3; K4 -2.6,-1.3; K6 -1.3,-1.3; K7 -0.65,-1.3; K8 0,-1.3; K9 0.65,-1.3; K10 1.3,-1.3; K12 2.6,-1.3; K13 3.25,-1.3; K14 3.9,-1.3; K15 4.55,-1.3; L1 -4.55,-1.95; L2 -3.9,-1.95; L3 -3.25,-1.95; L4 -2.6,-1.95; L12 2.6,-1.95; L13 3.25,-1.95; L14 3.9,-1.95; L15 4.55,-1.95; M1 -4.55,-2.6; M2 -3.9,-2.6; M3 -3.25,-2.6; M4 -2.6,-2.6; M5 -1.95,-2.6; M6 -1.3,-2.6; M7 -0.65,-2.6; M8 0,-2.6; M9 0.65,-2.6; M10 1.3,-2.6; M11 1.95,-2.6; M12 2.6,-2.6; M13 3.25,-2.6; M14 3.9,-2.6; M15 4.55,-2.6; N1 -4.55,-3.25; N2 -3.9,-3.25; N3 -3.25,-3.25; N4 -2.6,-3.25; N5 -1.95,-3.25; N6 -1.3,-3.25; N7 -0.65,-3.25; N8 0,-3.25; N9 0.65,-3.25; N10 1.3,-3.25; N11 1.95,-3.25; N12 2.6,-3.25; N13 3.25,-3.25; N14 3.9,-3.25; N15 4.55,-3.25; P1 -4.55,-3.9; P2 -3.9,-3.9; P3 -3.25,-3.9; P4 -2.6,-3.9; P5 -1.95,-3.9; P6 -1.3,-3.9; P7 -0.65,-3.9; P8 0,-3.9; P9 0.65,-3.9; P10 1.3,-3.9; P11 1.95,-3.9; P12 2.6,-3.9; P13 3.25,-3.9; P14 3.9,-3.9; P15 4.55,-3.9; R1 -4.55,-4.55; R2 -3.9,-4.55; R3 -3.25,-4.55; R4 -2.6,-4.55; R5 -1.95,-4.55; R6 -1.3,-4.55; R7 -0.65,-4.55; R8 0,-4.55; R9 0.65,-4.55; R10 1.3,-4.55; R11 1.95,-4.55; R12 2.6,-4.55; R13 3.25,-4.55; R14 3.9,-4.55; R15 4.55,-4.55

### Placement (x,y rotation side)
C1  48.74,20.61 90 top
C2  41.12,23.15 90 top
C3  39.22,23.15 90 top
C4  36.68,22.52 135 top
C5  36.05,19.97 180 top
C6  36.05,18.07 180 top
C7  48.74,53.63 90 top
C8  42.4,56.17 90 top
C9  40.49,56.17 90 top
C10  37.95,55.53 135 top
C11  37.31,52.99 180 top
C12  37.31,51.09 180 top
C13  48.74,10.45 90 top
C14  39.85,10.45 90 top
C15  48.74,34.58 90 top
C16  42.4,37.12 90 top
C17  40.49,37.12 90 top
C18  37.95,36.48 135 top
C19  37.31,33.95 180 top
C20  37.31,32.04 180 top
C21  50.65,15.53 0 top
C22  50.65,5.37 0 top
C23  50.65,48.55 0 top
C24  50.65,29.5 0 top
C25  -19.71,52.11 0 top  (outside the outline)
C26  -19.71,49.06 0 top  (outside the outline)
C27  28.42,18.2 180 top
C28  -20.09,42.45 0 top  (outside the outline)
C29  -20.09,38.64 0 top  (outside the outline)
C30  -20.09,34.83 0 top  (outside the outline)
C31  -20.09,31.02 0 top  (outside the outline)
C32  -20.09,27.21 0 top  (outside the outline)
C33  -20.09,23.4 0 top  (outside the outline)
C34  19.41,60.49 90 top
C35  22.2,60.49 90 top
C36  25,60.49 90 top
C37  27.79,60.49 90 top
C38  30.58,60.49 90 top
C39  33.38,60.49 90 top
C40  35.92,60.61 90 top
C41  12.02,52.33 270 bottom
C42  8.78,43.55 270 top
C43  7.15,52.65 180 top
C44  15.27,46.47 90 bottom
C45  14.62,46.47 90 bottom
C46  11.38,48.42 180 bottom
C47  10.07,50.38 0 bottom
C48  10.07,51.02 0 bottom
C49  16.57,48.42 0 bottom
C50  16.57,49.08 0 bottom
C51  16.57,49.72 0 bottom
C52  13.32,52.33 270 bottom
C53  13.98,52.33 270 bottom
C54  14.62,52.33 270 bottom
C55  15.6,48.42 0 bottom
C56  13.98,46.47 90 bottom
C57  57.51,9.82 0 top
C58  57.64,8.29 180 top
C59  39.85,60.87 0 top
DAC1  25.38,23.91 0 top
IC5  24.05,49.4 0 top
L1  -21.12,9.75 180 top  (outside the outline)
L2  -21.12,20.15 180 top  (outside the outline)
OA2  25.25,8.55 90 top
OA3  -17.55,14.95 90 top  (outside the outline)
PWR_3V3A  44.3,30.77 270 top
PWR_3V3D  44.3,49.82 270 top
PWR_+12V  44.3,16.8 270 top
PWR_-12V  44.3,6.64 270 top
R1  39.85,17.43 270 top
R2  39.85,14.89 270 top
R3  39.85,7.28 270 top
R4  39.85,4.73 270 top
R5  -19.71,58.2 0 top  (outside the outline)
R6  -19.71,55.15 0 top  (outside the outline)
R7  -21.12,11.7 180 top  (outside the outline)
R8  -21.12,18.2 180 top  (outside the outline)
U1  1.12,34.58 90 bottom
U2  -41.6,14.95 0 top  (outside the outline)
U$1  13.65,49.4 0 top

### Tracks (layer width: path | path; a pad name or v marks a point on that pad's centre or on a via)
3V3A  (7 unrouted)
3V3A_NR  (1 unrouted)
3V3D  (via drill 0.25)  (53 unrouted)
  Top 0.203: U$1.R1 8.78,44.53 C42.1
  Bottom 0.254: C41.1 v12.02,52.97 | C52.1 v13.32,52.97 | C53.1 v13.98,52.97 | C54.1 v14.62,52.97 | C48.1 v10.73,51.02 | C47.1 v10.73,50.38 | C46.1 v10.73,48.42 | C51.1 v17.23,49.72 | C50.1 v17.23,49.08 | C49.1 v17.23,48.42 | C56.1 v13.98,45.83 | C45.1 v14.62,45.83 | C44.1 v15.27,45.83
3V3D_NR  (1 unrouted)
+12V  (6 unrouted)
+12V_NR  (1 unrouted)
+12V_SENSE  (2 unrouted)
-12V  (2 unrouted)
-12V_NR  (1 unrouted)
-12V_SENSE  (2 unrouted)
GND  (via drill 0.25)  (133 unrouted)
  other vias: 12.68,50.38 13.32,50.38 13.98,50.38 14.62,50.38 14.62,49.72 14.62,49.08 14.62,48.42 13.98,48.42 13.98,49.08 13.98,49.72 13.32,49.72 13.32,49.08 13.32,48.42 12.68,48.42 12.68,49.08 12.68,49.72
N$1  (1 unrouted)
N$2  (1 unrouted)
N$3  (1 unrouted)
N$4  (1 unrouted)
N$5  (2 unrouted)
N$7  (2 unrouted)
N$8  (1 unrouted)
N$9  (1 unrouted)
N$10  (1 unrouted)
N$11  (2 unrouted)
N$12  (1 unrouted)
N$13  (2 unrouted)
N$26  (2 unrouted)
N$29  (2 unrouted)
VBAT
  Top 0.203: U$1.C1 C43.1
VIN  (8 unrouted)